# Altium schematic sheet Configuration.SchDoc
size 127 x 88 mm; SheetNumber: 3; SheetTotal: 5
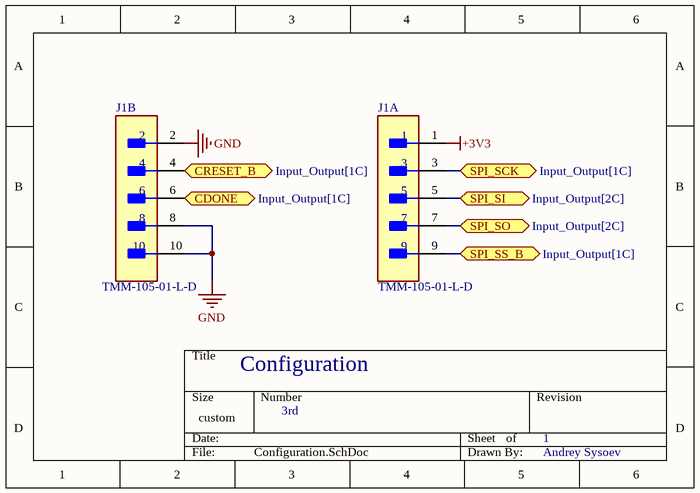
[diagram p0: Configuration.SchDoc]

## Parts
J1  TMM-105-01-L-D  [FP-TMM-105-01-L-D-MFG]  (parts A,B of 2)

## Ports
CDONE (bidir, see Input_Output[1C]), CRESET_B (bidir, see Input_Output[1C]), SPI_SCK (bidir, see Input_Output[1C]), SPI_SI (bidir, see Input_Output[2C]), SPI_SO (bidir, see Input_Output[2C]), SPI_SS_B (bidir, see Input_Output[1C])

## Nets
+3V3: J1.1
GND: J1.2 J1.8 J1.10
CDONE: J1.6 ; port CDONE
CRESET_B: J1.4 ; port CRESET_B
SPI_SCK: J1.3 ; port SPI_SCK
SPI_SI: J1.5 ; port SPI_SI
SPI_SO: J1.7 ; port SPI_SO
SPI_SS_B: J1.9 ; port SPI_SS_B

## Notes on the sheet
- Configuration
- 3rd
- 1
- Andrey Sysoev

## Library data of the parts
J1 = CMP-031-00007-1: TMM ROHS3Compliant COMMERCIAL 2012 Connector Header -55C~125C 3.2A per Contact 500V 3.94mm; Max Operating Temperature: 125°C; Min Operating Temperature: -55°C